# EAGLE design base (EAGLE 6.5.0)
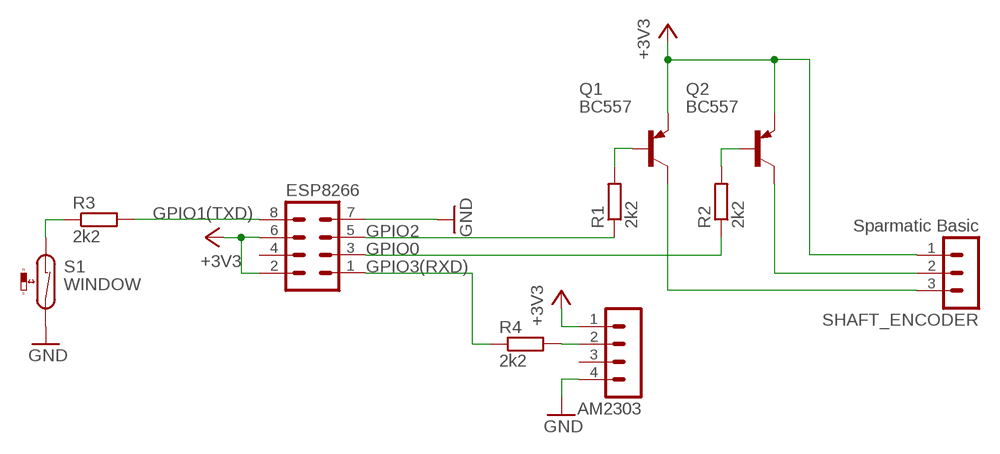
[diagram p0: schematic, sheet 1]

## Parts
AM2303  MA04-1  [MA04-1]
ESP8266  MA04-2  [MA04-2]
Q1  BC557  [TO92-EBC]
Q2  BC557  [TO92-EBC]
R1  2k2  R-EU_0204/7  [0204/7]
R2  2k2  R-EU_0204/7  [0204/7]
R3  2k2  R-EU_0204/7  [0204/7]
R4  2k2  R-EU_0204/7  [0204/7]
S1  WINDOW  REED-SWITCH-MK6-8-H  [MK6-8-A]
SHAFT_ENCODER  Sparmatic Basic  MA03-1  [MA03-1]

## Nets
+3V3: AM2303.1 ESP8266.2 ESP8266.6 Q1.E Q2.E SHAFT_ENCODER.1
GND: AM2303.4 ESP8266.7 S1.2
GPIO0: ESP8266.3 R2.1
GPIO1(TXD): ESP8266.8 R3.2
GPIO2: ESP8266.5 R1.1
GPIO3(RXD): ESP8266.1 R4.1
N$1: Q1.B R1.2
N$2: Q2.B R2.2
N$3: R3.1 S1.1
N$4: Q2.C SHAFT_ENCODER.2
N$5: Q1.C SHAFT_ENCODER.3
N$6: AM2303.2 R4.2
Unconnected: AM2303.3 ESP8266.4

## Library data of the parts
AM2303 = con-lstb:MA04-1: PIN HEADER; OC_FARNELL: unknown; OC_NEWARK: unknown
ESP8266 = con-lstb:MA04-2: PIN HEADER; OC_FARNELL: unknown; OC_NEWARK: unknown
Q1 Q2 = transistor-pnp:BC557*: PNP Transistror
R1-R4 = rcl:R-EU_: RESISTOR, European symbol
S1 = switch-reed:REED-SWITCH-: Reed Sensor; MF: MEDER; MPN: MK6-8-H; OC_FARNELL: 1079482
SHAFT_ENCODER = con-lstb:MA03-1: PIN HEADER; OC_FARNELL: unknown; OC_NEWARK: unknown

## Board
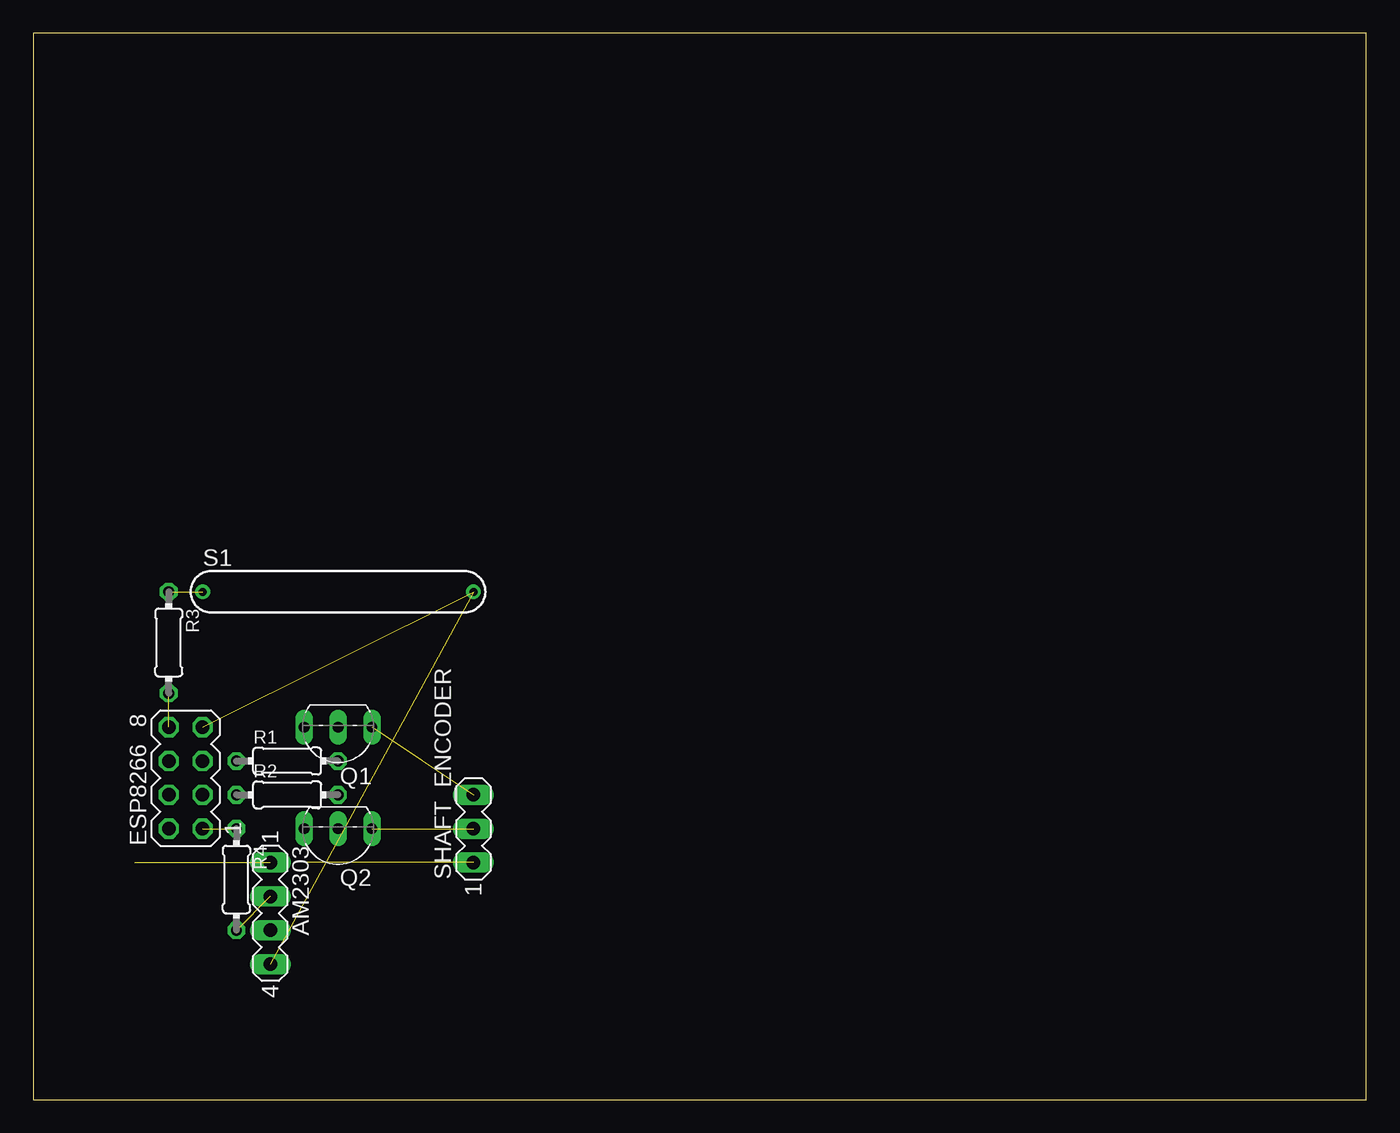
[diagram p1: board, top side]
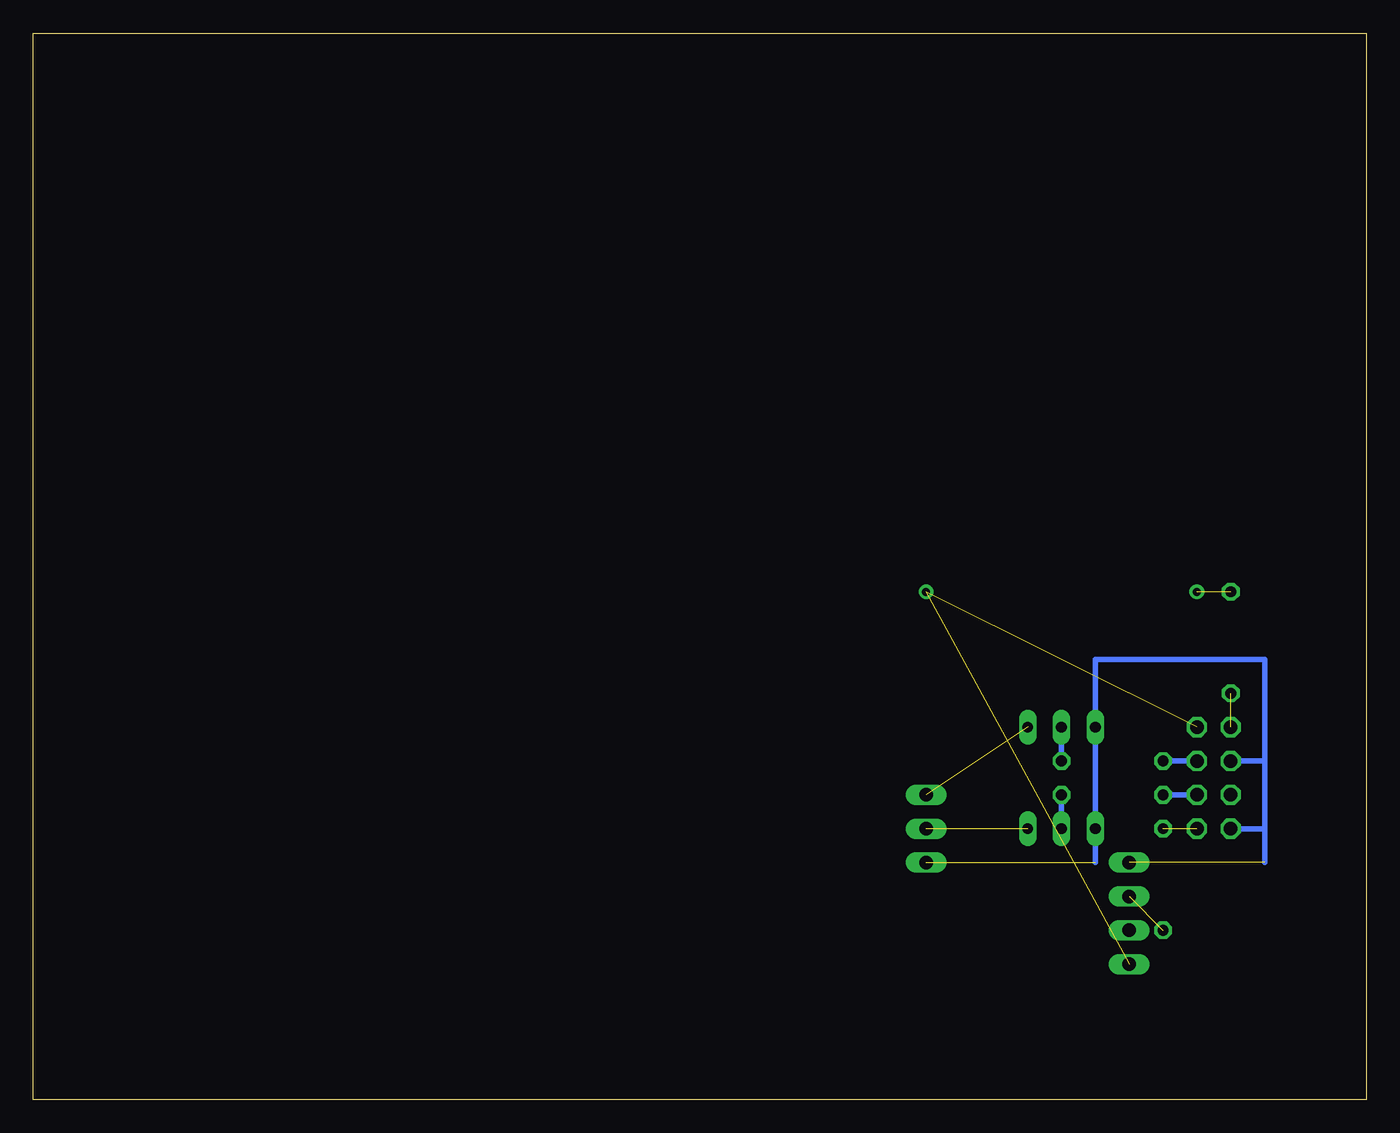
[diagram p2: board, bottom side, seen from below]

Size 100 x 80 mm. Coordinates in mm from the lower left corner, seen from the top.
Outline: 0,0 100,0 100,80 0,80 0,0
Copper layers (1*16): Top 0.035mm / dielectric 1.5mm / Bottom 0.035mm
Design rules "default": minimum track width 10mil, minimum drill 24mil, track to track 8mil, track to pad 8mil, pad to pad 8mil, via to via 8mil, smd to smd 8mil, copper to edge 40mil, drill to drill 8mil, minimum pad ring 10mil, minimum via ring 8mil, stop-mask expansion 4mil, vias tented up to drill 0mil, thermal gap 10mil

### Footprints (pad centres in the part's own frame; a part is rotated, then mirrored left to right if it is on the bottom)
MA04-1 = drill 1.016 long: 1 -3.81,0; 2 -1.27,0; 3 1.27,0; 4 3.81,0
MA04-2 = drill 1.016 octagon: 1 -3.81,-1.27; 2 -3.81,1.27; 3 -1.27,-1.27; 4 -1.27,1.27; 5 1.27,-1.27; 6 1.27,1.27; 7 3.81,-1.27; 8 3.81,1.27
TO92-EBC = drill 0.813 long: B 0,-1.27; C -2.54,-1.27; E 2.54,-1.27
0204/7 = drill 0.813 octagon: 1 -3.81,0; 2 3.81,0
MK6-8-A = drill 0.6 pad 1.016: 1 -10.16,0; 2 10.16,0
MA03-1 = drill 1.016 long: 1 -2.54,0; 2 0,0; 3 2.54,0

### Placement (x,y rotation side)
AM2303  17.78,13.97 270 top
ESP8266  11.43,24.13 90 top
Q1  22.86,26.67 180 top
Q2  22.86,19.05 180 top
R1  19.05,25.4 0 top
R2  19.05,22.86 0 top
R3  10.16,34.29 270 top
R4  15.24,16.51 270 top
S1  22.86,38.1 0 top
SHAFT_ENCODER  33.02,20.32 90 top

### Tracks (layer width: path | path; a pad name or v marks a point on that pad's centre or on a via)
+3V3  (2 unrouted)
  Bottom 0.406: Q1.E Q2.E | ESP8266.2 7.62,20.32 | 7.62,20.32 7.62,25.4 | 7.62,25.4 ESP8266.6 | Q2.E 20.32,17.78 | 7.62,17.78 7.62,20.32 | Q2.E 20.32,33.02 7.62,33.02 7.62,25.4
GND  (2 unrouted)
GPIO0
  Bottom 0.406: ESP8266.3 R2.1
GPIO1(TXD)  (1 unrouted)
GPIO2
  Bottom 0.406: R1.1 ESP8266.5
GPIO3(RXD)  (1 unrouted)
N$1
  Bottom 0.406: R1.2 Q1.B
N$2
  Bottom 0.406: Q2.B R2.2
N$3  (1 unrouted)
N$4  (1 unrouted)
N$5  (1 unrouted)
N$6  (1 unrouted)